# EAGLE design 102_buzzer_raspberrypi (EAGLE 9.6.2)
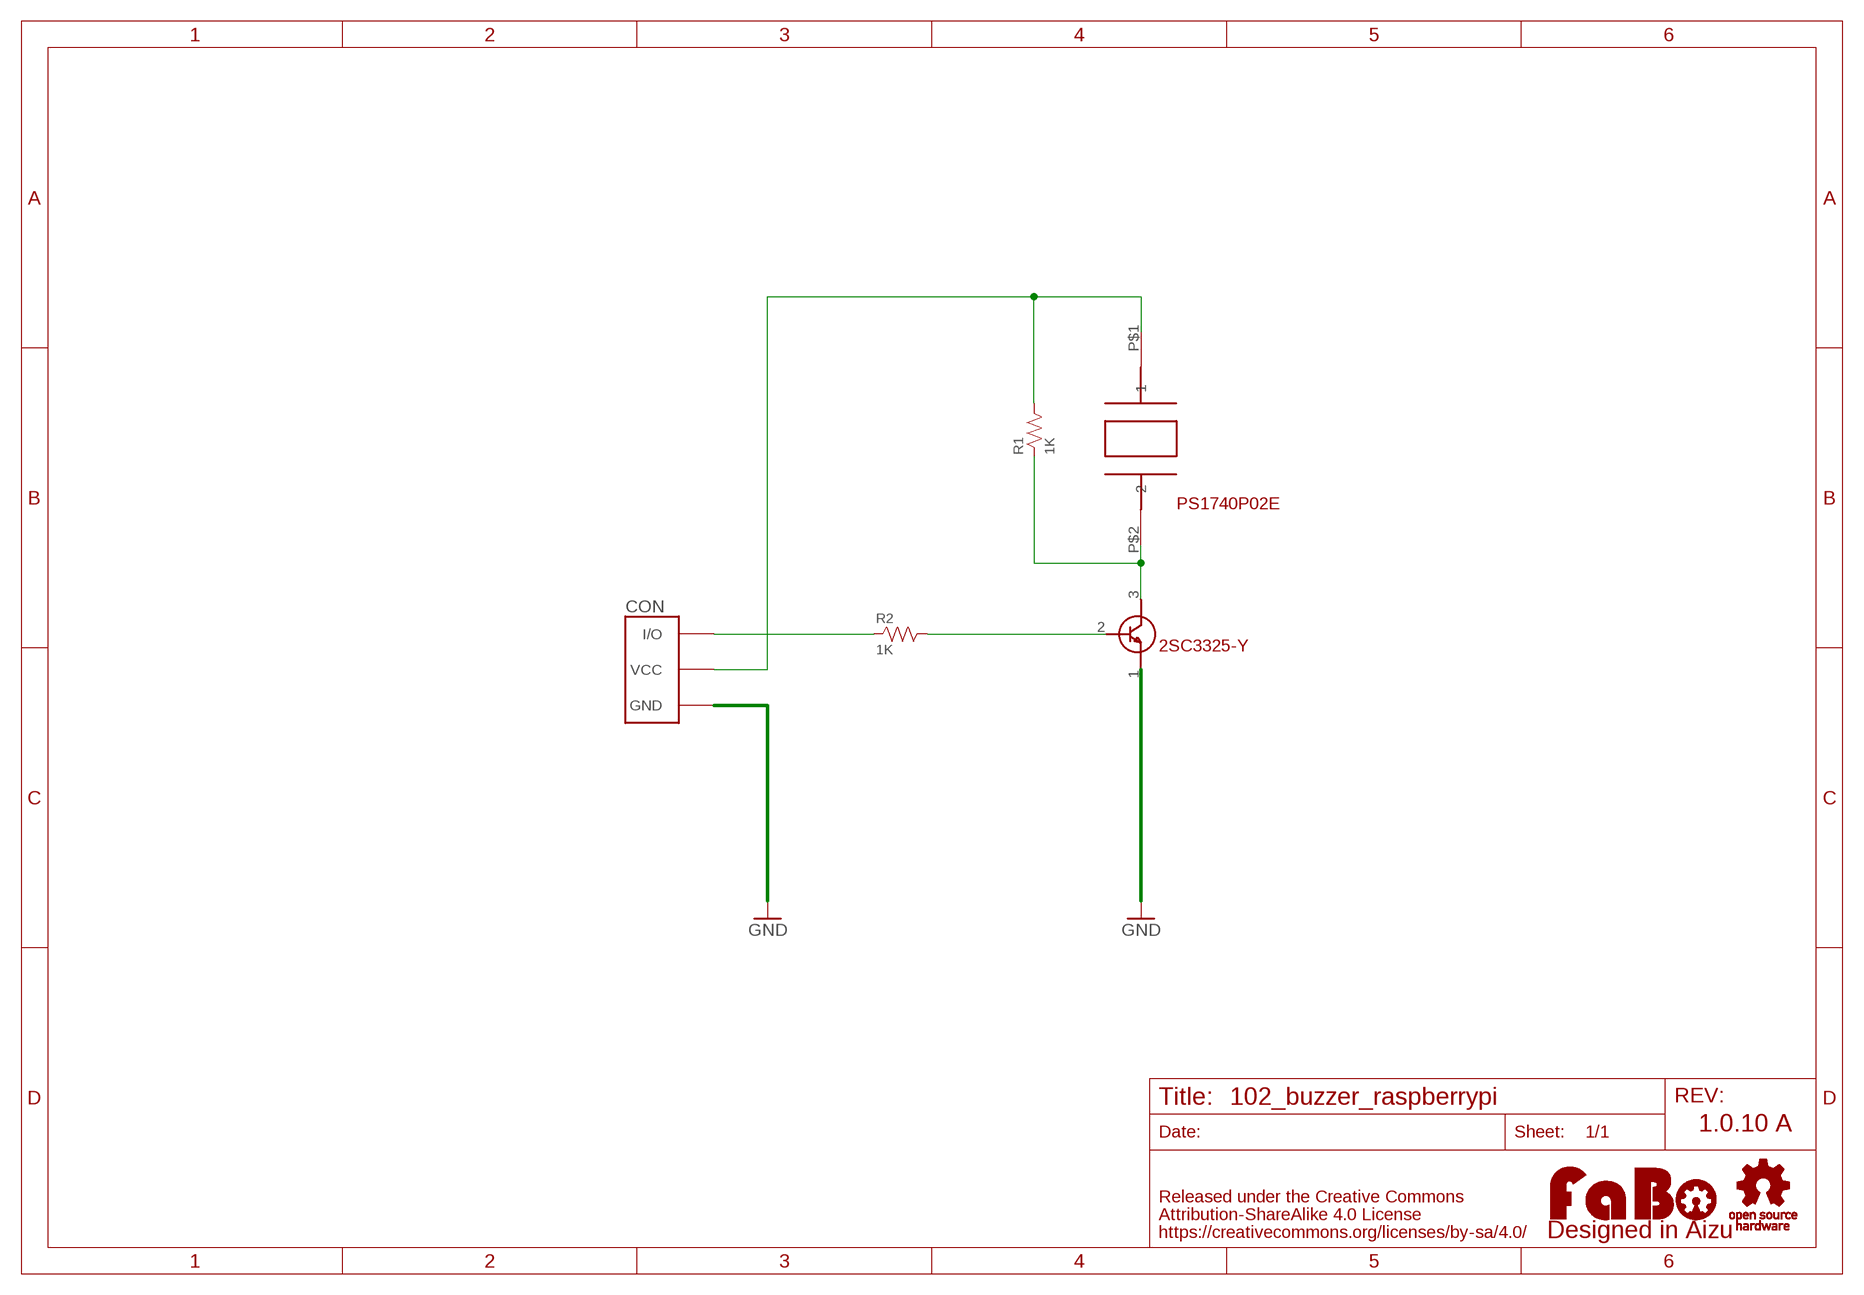
[diagram p0: schematic, sheet 1]

## Parts
CON  FABO_BRICK_3PIN_INNER  [FABO_BRICK_3PIN_HOLE_CON]
LOGO1  LOGO_FABO-M  [LOGO_FABO_M]
R1  1K  RESISTOR-0603  [0603]
R2  1K  RESISTOR-0603  [0603]
T1  2SC3325-Y  [SC-59]
U1  PS1740P02E  [PS1740P02E]
U$3  LOGO_OSHW-M_BOTTOM  [LOGO_OSHW_M_BOTTOM]

## Nets
GND: CON.GND T1.1(E)
N$1: CON.I/O R2.1
N$2: CON.VCC R1.2 U1.P$1
N$3: R1.1 T1.3(C) U1.P$2
N$5: R2.2 T1.2(B)

## Notes on the sheet
- PS1740P02E
- 1.0.10 A

## Library data of the parts
CON = FaBo-Template 3:FABO_BRICK_3PIN_INNER
LOGO1 = component:LOGO_FABO
R1 R2 = FaBo-Resistors:RESISTOR: RESISTOR
T1 = FaBo-Transistor:2SC3325-Y
U1 = FaBo:PS1740P02E
U$3 = FaBo-etc:LOGO_OSHW

## Board
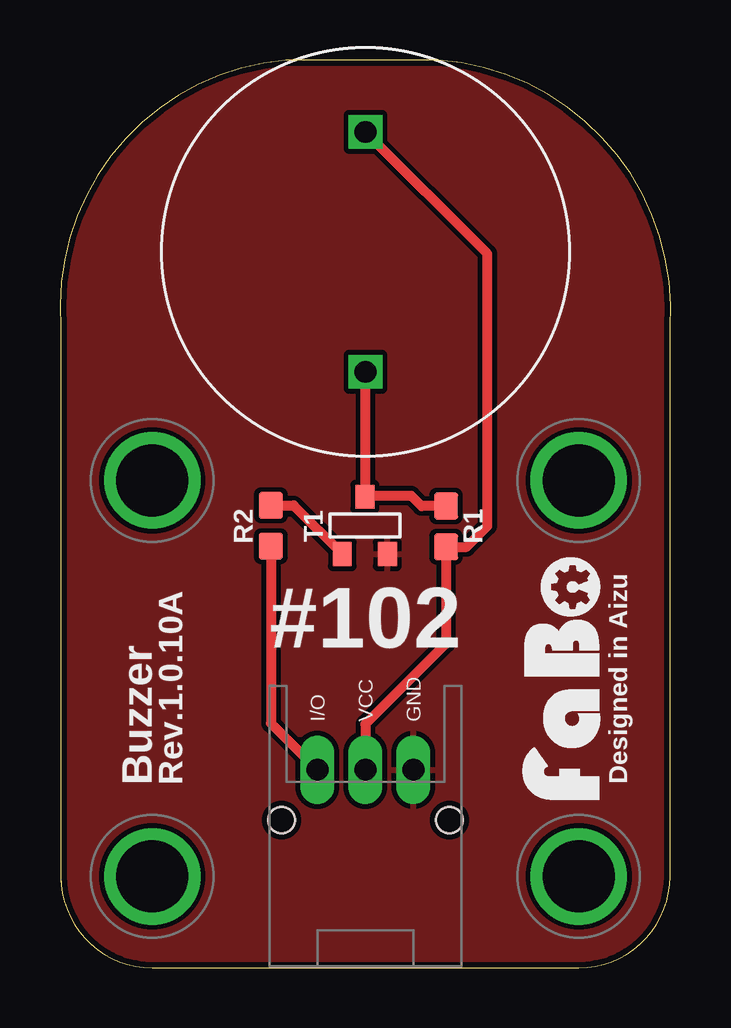
[diagram p1: board, top side]
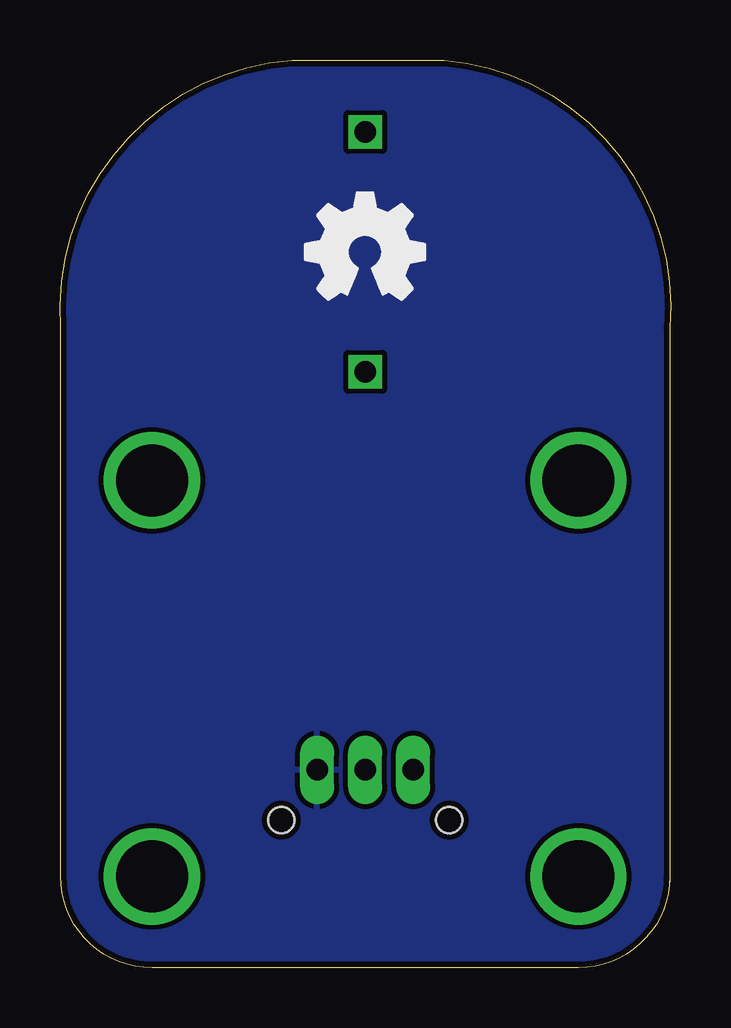
[diagram p2: board, bottom side, seen from below]

Size 25.46 x 37.85 mm. Coordinates in mm from the lower left corner, seen from the top.
Outline: 0.04,3.81 arc90 3.85,0 21.63,0 arc90 25.44,3.81 25.44,26.67 arc90 15.79,37.85 9.44,37.85 arc90 0.04,26.67 0.04,3.81
Outline: 0.04,3.81 0.04,3.56
Copper layers (1*16): Top 0.035mm / dielectric 1.6mm / Bottom 0.035mm
Design rules "PCBway": minimum track width 6mil, minimum drill 12mil, track to track 6mil, track to pad 6mil, pad to pad 6mil, via to via 6mil, smd to smd 6mil, copper to edge 10mil, drill to drill 10mil, minimum pad ring 10mil, minimum via ring 6mil, stop-mask expansion 2mil, vias tented up to drill 100mil, thermal gap 8mil

### Footprints (pad centres in the part's own frame; a part is rotated, then mirrored left to right if it is on the bottom)
FABO_BRICK_3PIN_HOLE_CON = drill 0.9 pad 1.422 long: GND 2,-8.255; I/O -2,-8.255; VCC 0,-8.255 | drill 3 pad 3.81: P$1 -8.89,3.81; P$2 8.89,3.81; P$3 -8.89,-12.7; P$4 8.89,-12.7 | hole 1.1: -3.5,-10.355; 3.5,-10.355
0603 = smd 1.1 x 1: 1 -0.85,0; 2 0.85,0
SC-59 = smd 0.787 x 0.991: 1 -0.914,1.168; 2 0.965,1.168; 3 0.025,-1.219
PS1740P02E = drill 0.9 square: P$1 0,5; P$2 0,-5

### Placement (x,y rotation side)
CON  12.74,16.51 0 top
LOGO1  22.9,12.06 90 top
R1  16.1,18.4 270 top
R2  8.8,18.43 90 top
T1  12.74,18.41 180 top
U1  12.74,29.84 0 top
U$3  12.74,29.84 0 top

### Tracks (layer width: path | path; a pad name or v marks a point on that pad's centre or on a via)
GND
  pour Top (isolate 0.203): 0.04,0 0.04,38.73 25.44,38.73 25.44,0
  pour Bottom (isolate 0.203): 0.04,0 0.04,38.73 25.44,38.73 25.44,0
N$1
  Top 0.406: R2.1 8.8,10.2 CON.I/O
N$2
  Top 0.406: CON.VCC 12.74,10.16 16.1,13.52 R1.2 16.95,17.55 17.82,18.41 17.82,29.77 U1.P$1
N$3
  Top 0.406: R1.1 15.08,19.25 14.64,19.68 12.76,19.68 T1.3 12.74,19.66 U1.P$2
N$5
  Top 0.406: R2.2 9.74,19.28 T1.2

### Text on the board
tPlace: #102 | Designed in Aizu | Buzzer | Rev.1.0.10A